# EAGLE design VibeBrain2 (EAGLE 9.6.2)
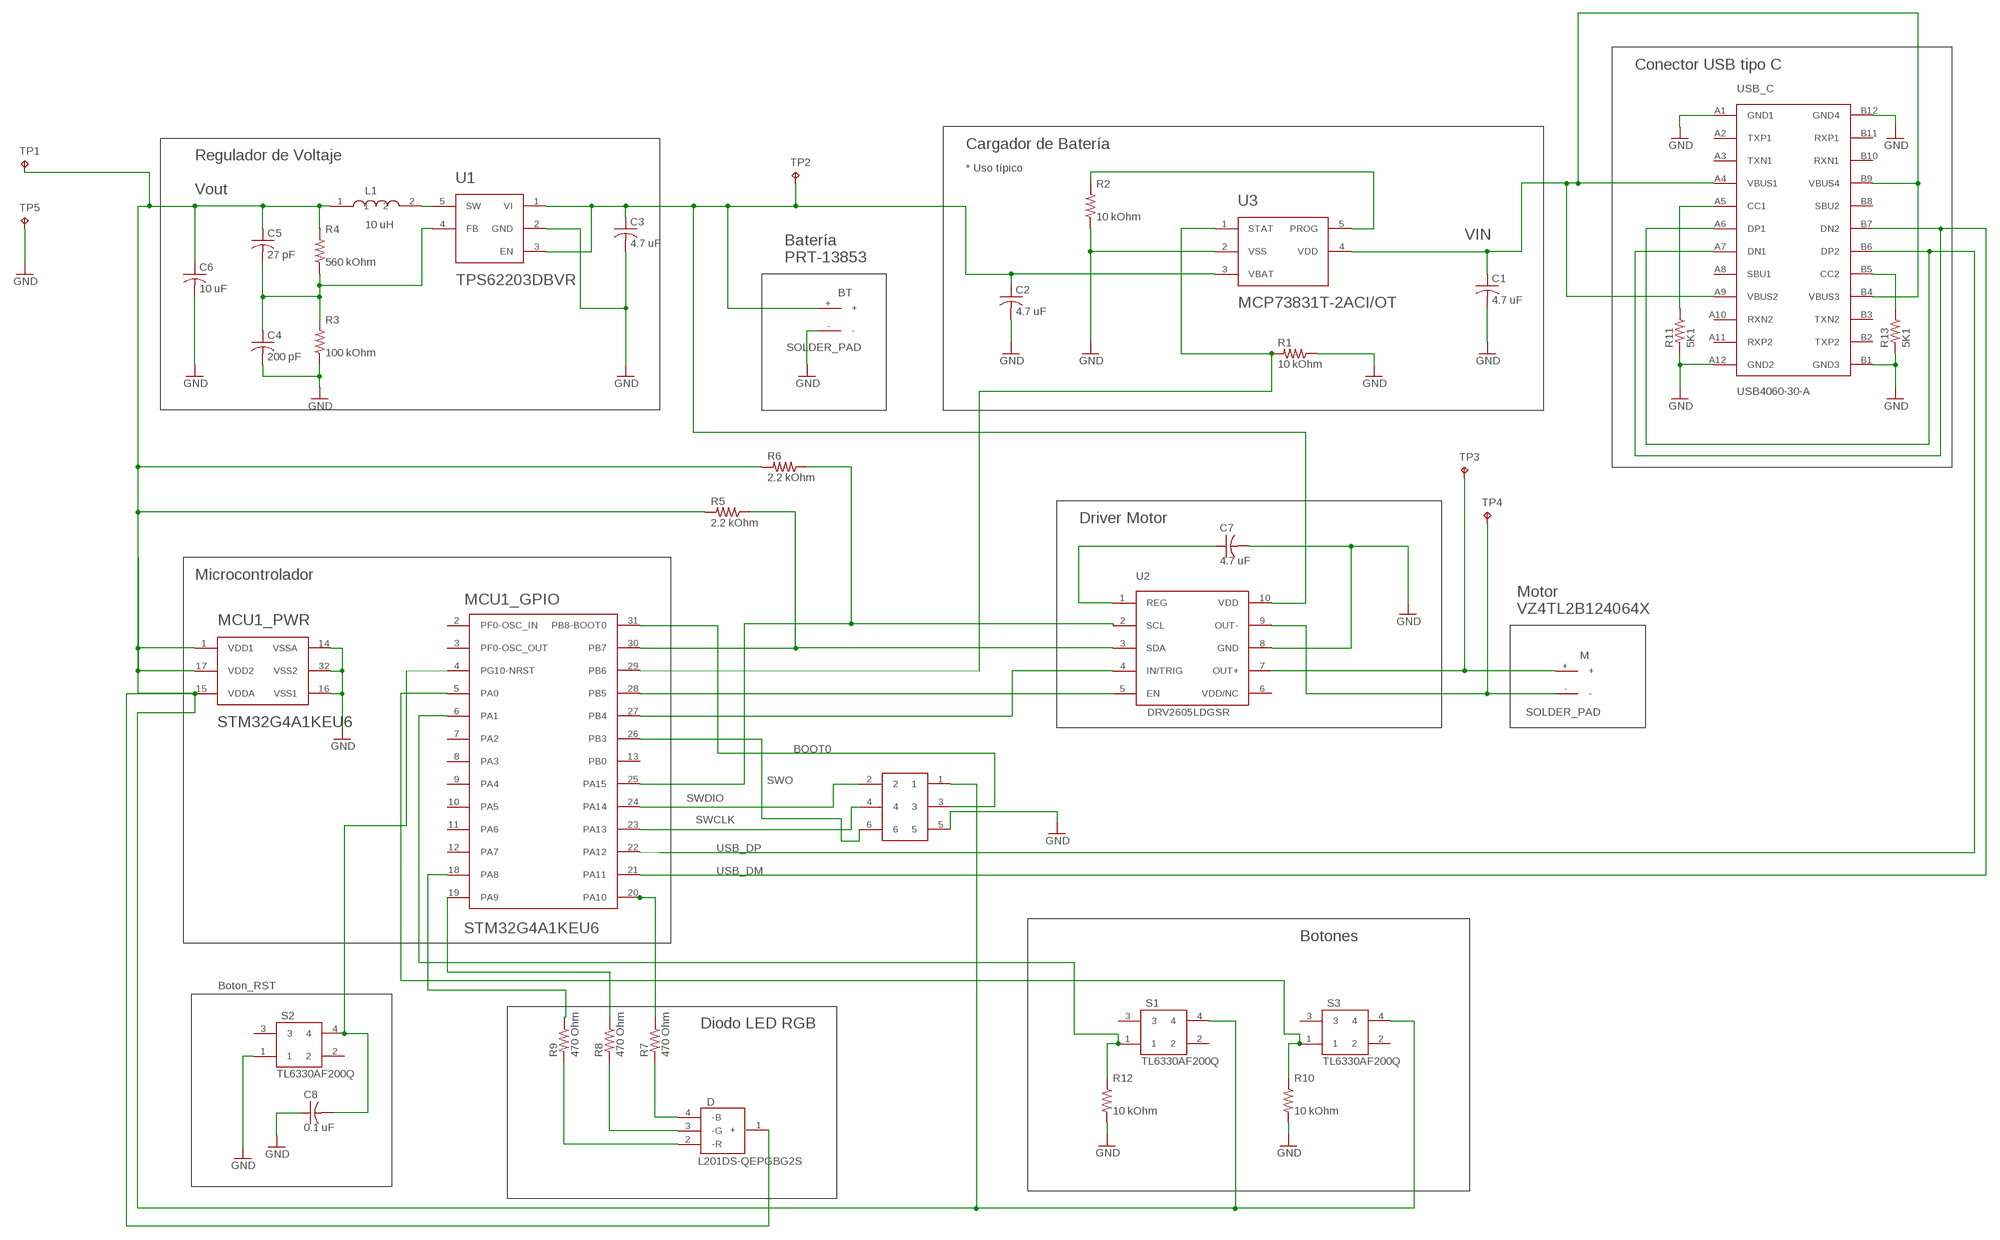
[diagram p0: schematic, sheet 1]

## Parts
BT  SOLDER_PAD  PADS  [SMD]
C1  4.7 uF  C-USC0402  [C0402]
C2  4.7 uF  C-USC0402  [C0402]
C3  4.7 uF  C-USC0402  [C0402]
C4  200 pF  C-USC0402  [C0402]
C5  27 pF  C-USC0402  [C0402]
C6  10 uF  C-USC0402  [C0402]
C7  4.7 uF  C-USC0402  [C0402]
C8  0.1 uF  C-USC0402  [C0402]
D  L201DS-QEPGBG2S  [SMD]
J1  TC2030-IDC  TC2030-IDC-FP  [TC2030-IDC-FP]
L1  10 uH  LQW15DN100M00D-ME  [SMD]
M  SOLDER_PAD  PADS  [SMD]
MCU1  STM32G4A1KEU6  STM32G4A1KEU6  [32-UFQFPN(5X5)]
R1  10 kOhm  R-US_R0402  [R0402]
R2  10 kOhm  R-US_R0402  [R0402]
R3  100 kOhm  R-US_R0402  [R0402]
R4  560 kOhm  R-US_R0402  [R0402]
R5  2.2 kOhm  R-US_R0402  [R0402]
R6  2.2 kOhm  R-US_R0402  [R0402]
R7  470 Ohm  R-US_R0402  [R0402]
R8  470 Ohm  R-US_R0402  [R0402]
R9  470 Ohm  R-US_R0402  [R0402]
R10  10 kOhm  R-US_R0402  [R0402]
R11  5K1  R-US_R0402  [R0402]
R12  10 kOhm  R-US_R0402  [R0402]
R13  5K1  R-US_R0402  [R0402]
S1  TL6330AF200Q  [SWITCH]
S2  TL6330AF200Q  [SWITCH]
S3  TL6330AF200Q  [SWITCH]
TP1  TPTP07SQ  [TP07SQ]
TP2  TPTP07SQ  [TP07SQ]
TP3  TPTP07SQ  [TP07SQ]
TP4  TPTP07SQ  [TP07SQ]
TP5  TPTP07SQ  [TP07SQ]
U1  TPS62203DBVR  [SOT-23-5]
U2  DRV2605LDGSR  [10-VSSOP]
U3  MCP73831T-2ACI/OT  MCP73831T-2ACI-OT  [SOT-23-5]
USB_C  USB4060-30-A  [USB_C]

## Nets
A2: C7.1 U2.1(REG)
FB: C4.1 C5.2 R3.2 R4.1 U1.4(FB)
GND: BT.- C1.2 C2.2 C3.2 C4.2 C6.2 C7.2 C8.1 J1.5 MCU1.14(_PWR:VSSA) MCU1.16(_PWR:VSS1) MCU1.32(_PWR:VSS2) R1.1 R2.1 R3.1 R10.2 R11.2 R12.2 R13.2 S2.1 TP5.TP U1.2(GND) U2.8(GND) U3.2(VSS) USB_C.A1(GND1) USB_C.A12(GND2) USB_C.B1(GND3) USB_C.B12(GND4)
N$1: MCU1.30(_GPIO:PB7) R5.1 U2.3(SDA)
N$2: MCU1.29(_GPIO:PB6) R1.2 U3.1(STAT)
N$3: J1.3 MCU1.31(_GPIO:PB8-BOOT0)
N$4: MCU1.28(_GPIO:PB5) U2.5(EN)
N$5: MCU1.27(_GPIO:PB4) U2.4(IN/TRIG)
N$6: M.+ TP3.TP U2.7(OUT+)
N$7: M.- TP4.TP U2.9(OUT-)
N$8: MCU1.22(_GPIO:PA12) USB_C.A6(DP1) USB_C.B6(DP2)
N$9: MCU1.19(_GPIO:PA9) R8.1
N$10: MCU1.21(_GPIO:PA11) USB_C.A7(DN1) USB_C.B7(DN2)
N$11: MCU1.5(_GPIO:PA0) R10.1 S3.1
N$12: MCU1.6(_GPIO:PA1) R12.1 S1.1
N$13: MCU1.20(_GPIO:PA10) R7.1
N$14: J1.2 MCU1.24(_GPIO:PA14)
N$15: D.4(-B) R7.2
N$16: D.3(-G) R8.2
N$17: D.2(-R) R9.2
N$18: J1.6 MCU1.26(_GPIO:PB3)
N$20: J1.4 MCU1.23(_GPIO:PA13)
N$21: MCU1.25(_GPIO:PA15) R6.1 U2.2(SCL)
N$22: L1.2 U1.5(SW)
N$23: C8.2 MCU1.4(_GPIO:PG10-NRST) S2.4
N$24: MCU1.18(_GPIO:PA8) R9.1
N$25: R11.1 USB_C.A5(CC1)
N$26: R13.1 USB_C.B5(CC2)
PROG: R2.2 U3.5(PROG)
REG_OUT: C5.1 C6.1 D.1(+) J1.1 L1.1 MCU1.1(_PWR:VDD1) MCU1.15(_PWR:VDDA) MCU1.17(_PWR:VDD2) R4.2 R5.2 R6.2 S1.4 S3.4 TP1.TP
VBAT: BT.+ C2.1 C3.1 TP2.TP U1.1(VI) U1.3(EN) U2.10(VDD) U3.3(VBAT)
VDD: C1.1 U3.4(VDD) USB_C.A4(VBUS1) USB_C.A9(VBUS2) USB_C.B4(VBUS3) USB_C.B9(VBUS4)
Unconnected: MCU1.2(_GPIO:PF0-OSC_IN) MCU1.3(_GPIO:PF0-OSC_OUT) MCU1.7(_GPIO:PA2) MCU1.8(_GPIO:PA3) MCU1.9(_GPIO:PA4) MCU1.10(_GPIO:PA5) MCU1.11(_GPIO:PA6) MCU1.12(_GPIO:PA7) MCU1.13(_GPIO:PB0) S1.2 S1.3 S2.2 S2.3 S3.2 S3.3 USB_C.A2(TXP1) USB_C.A3(TXN1) USB_C.A8(SBU1) USB_C.A10(RXN2) USB_C.A11(RXP2) USB_C.B2(TXP2) USB_C.B3(TXN2) USB_C.B8(SBU2) USB_C.B10(RXN1) USB_C.B11(RXP1)

## Notes on the sheet
- Conector USB tipo C
- Cargador de Batería
- Regulador de Voltaje
- * Uso típico
- Vout
- VIN
- Batería
  PRT-13853
- Driver Motor
- Microcontrolador
- Motor
  VZ4TL2B124064X
- BOOT0
- SWO
- SWDIO
- SWCLK
- USB_DP
- USB_DM
- Botones
- Boton_RST
- Diodo LED RGB

## Power pins joined to a net without a drawn wire
VDD/NC: U2.6(VDD/NC)

## Library data of the parts
BT M = PADS:PADS
C1-C3 C7 = rcl:C-US: CAPACITOR, American symbol; PARTNO: GRM155R60J475ME47J; SPICEPREFIX: C
C4 = rcl:C-US: CAPACITOR, American symbol; PARTNO: GCM1555C1H201FA16D; SPICEPREFIX: C
C5 = rcl:C-US: CAPACITOR, American symbol; PARTNO: GCM1555C1H270JA16D; SPICEPREFIX: C
C6 = rcl:C-US: CAPACITOR, American symbol; PARTNO: GRM155R60J106ME05J; SPICEPREFIX: C
C8 = rcl:C-US: CAPACITOR, American symbol; PARTNO: GCM155R71C104KA55J; SPICEPREFIX: C
D = L201DS-QEPGBG2S-American Opto Plus LED:L201DS-QEPGBG2S; PARTNO: L201DS-QEPGBG2S
J1 = TC2030-IDC:TC2030-IDC-FP; PARTNO: TC2030-IDC
L1 = LQW15DN100M00D:LQW15DN100M00D-ME; PARTNO: LQW15DN100M00D
MCU1 = STM32G4A1KEU6-STM:STM32G4A1KEU6; PARTNO: STM32G4A1KEU6
R1 R2 R10 R12 = rcl:R-US_: RESISTOR, American symbol; PARTNO: RMCF0402FT10K0; SPICEPREFIX: R
R3 = rcl:R-US_: RESISTOR, American symbol; PARTNO: RMCF0402FT100K; SPICEPREFIX: R
R4 = rcl:R-US_: RESISTOR, American symbol; PARTNO: ERJ-2RKF5603X; SPICEPREFIX: R
R5 R6 = rcl:R-US_: RESISTOR, American symbol; PARTNO: RMCF0402JT2K20; SPICEPREFIX: R
R7-R9 = rcl:R-US_: RESISTOR, American symbol; PARTNO: RMCF0402FT470R; SPICEPREFIX: R
R11 R13 = rcl:R-US_: RESISTOR, American symbol; PARTNO: RC0402FR-075K1L; SPICEPREFIX: R
S1-S3 = TL6330AF200Q-E-SWITCH:TL6330AF200Q; PARTNO: TL6330AF200Q
TP1-TP5 = testpad:TP: Test pad
U1 = TPS62203DBVR-TI:TPS62203DBVR; PARTNO: TPS62203DBVR
U2 = DRV2605LDGSR-TI:DRV2605LDGSR; PARTNO: DRV2605LDGSR
U3 = MCP73831T_2ACI_OT-MT:MCP73831T-2ACI-OT; PARTNO: MCP73831T-2ACI/OT
USB_C = USB4060-30-A-GCT:USB4060-30-A; PARTNO: USB4060-30-A

## Board
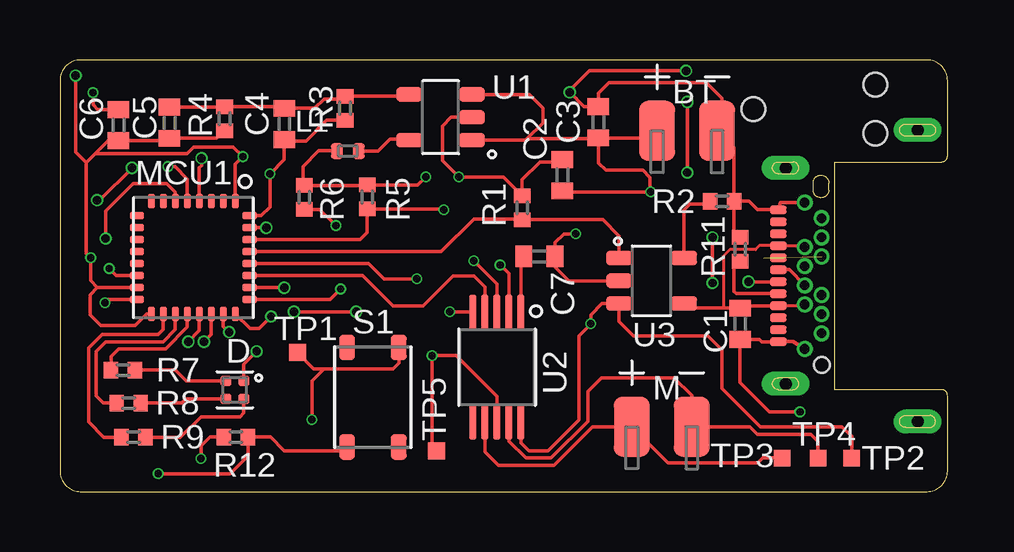
[diagram p1: board, top side]
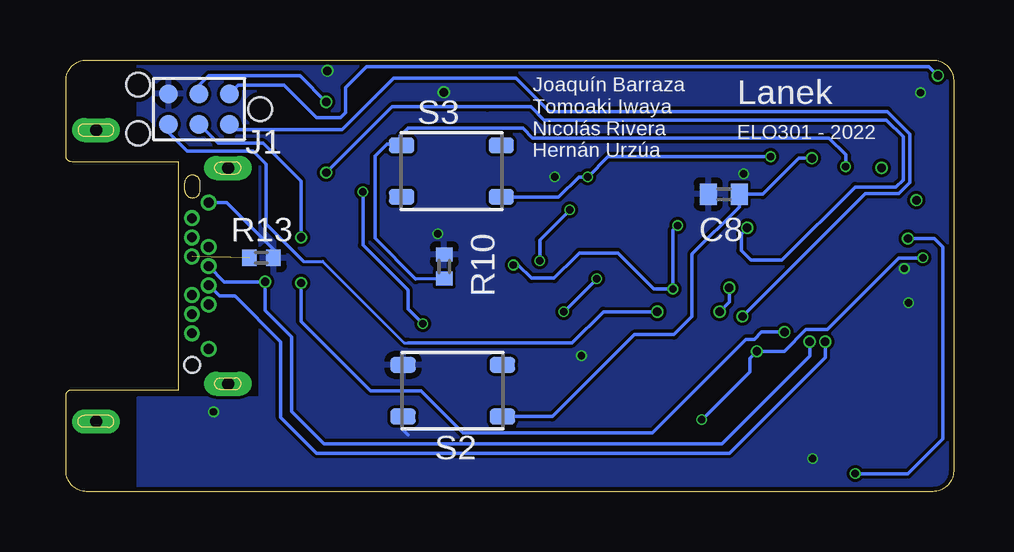
[diagram p2: board, bottom side, seen from below]

Size 37 x 18 mm. Coordinates in mm from the lower left corner, seen from the top.
Outline: 32.3,4.25 32.3,13.75 36.75,13.75 arc90 37,14 37,17.15 arc90 36.15,18 0.85,18 arc90 0,17.15 0,0.85 arc90 0.85,0 36.15,0 arc90 37,0.85 37,4 arc90 36.75,4.25 32.3,4.25
Copper layers (1*16): Top 0.035mm / dielectric 1.6mm / Bottom 0.035mm
Design rules "jlcpcb-2layers *": minimum track width 5mil, minimum drill 0.3mm, track to track 5mil, track to pad 5mil, pad to pad 5mil, via to via 5mil, smd to smd 5mil, copper to edge 0.2mm, drill to drill 6mil, minimum pad ring 0.13mm, minimum via ring 3mil, stop-mask expansion 4mil, vias tented up to drill 15mil, thermal gap 10mil

### Footprints (pad centres in the part's own frame; a part is rotated, then mirrored left to right if it is on the bottom)
SMD = smd 1.5 x 2.5: + -1.25,0; - 1.25,0
C0402 = smd 0.7 x 0.9: 1 -0.65,0; 2 0.65,0
SMD' = smd 0.45 x 0.45: 1 0.375,0.375; 2 0.375,-0.375; 3 -0.375,-0.375; 4 -0.375,0.375
TC2030-IDC-FP = smd 0.787 x 0.787: 1 -1.27,-0.635; 2 -1.27,0.635; 3 0,-0.635; 4 0,0.635; 5 1.27,-0.635; 6 1.27,0.635 | hole 0.993: 2.54,-1.016; 2.54,1.016; -2.54,0
SMD'' = smd 0.5 x 0.66: 1 -0.45,0; 2 0.45,0
32-UFQFPN(5X5) = smd 0.6 x 0.3: 1 -2.35,1.75; 2 -2.35,1.25; 3 -2.35,0.75; 4 -2.35,0.25; 5 -2.35,-0.25; 6 -2.35,-0.75; 7 -2.35,-1.25; 8 -2.35,-1.75; 17 2.35,-1.75; 18 2.35,-1.25; 19 2.35,-0.75; 20 2.35,-0.25; 21 2.35,0.25; 22 2.35,0.75; 23 2.35,1.25; 24 2.35,1.75 | smd 0.3 x 0.6: 9 -1.75,-2.35; 10 -1.25,-2.35; 11 -0.75,-2.35; 12 -0.25,-2.35; 13 0.25,-2.35; 14 0.75,-2.35; 15 1.25,-2.35; 16 1.75,-2.35; 25 1.75,2.35; 26 1.25,2.35; 27 0.75,2.35; 28 0.25,2.35; 29 -0.25,2.35; 30 -0.75,2.35; 31 -1.25,2.35; 32 -1.75,2.35
R0402 = smd 0.6 x 0.7: 1 -0.5,0; 2 0.5,0
SWITCH = smd 1.05 x 0.65: 1 -2.075,1.075; 2 2.075,1.075; 3 -2.075,-1.075; 4 2.075,-1.075
TP07SQ = smd 0.7 x 0.7: TP 0,0
SOT-23-5 = smd 1.1 x 0.6: 1 -1.3,0.95; 2 -1.3,0; 3 -1.3,-0.95; 4 1.3,-0.95; 5 1.3,0.95
10-VSSOP = smd 1.45 x 0.3: 1 -2.3,1; 2 -2.3,0.5; 3 -2.3,0; 4 -2.3,-0.5; 5 -2.3,-1; 6 2.3,-1; 7 2.3,-0.5; 8 2.3,0; 9 2.3,0.5; 10 2.3,1
SOT-23-5' = smd 1.1 x 0.6: 1 -1.35,0.9; 2 -1.35,-0.05; 3 -1.35,-1; 4 1.35,-1; 5 1.35,0.9
USB_C = smd 0.35 x 0.7: A1 -2.749,1.11; A2 -2.249,1.11; A3 -1.749,1.11; A4 -1.249,1.11; A5 -0.749,1.11; A6 -0.249,1.11; A7 0.251,1.11; A8 0.751,1.11; A9 1.251,1.11; A10 1.751,1.11; A11 2.251,1.11; A12 2.751,1.11 | drill 0.4 pad 0.65: B1 3.05,0; B2 2.4,-0.7; B3 1.6,-0.7; B4 1.2,0; B5 0.8,-0.7; B6 0.4,0; B7 -0.4,0; B8 -0.8,-0.7; B9 -1.2,0; B10 -1.6,-0.7; B11 -2.4,-0.7; B12 -3.05,0 | drill 0.5 pad 1 long: SHIELD1 -4.5,0.8; SHIELD2 4.5,0.8; SHIELD3 -6.075,-4.7; SHIELD4 6.075,-4.7 | hole 0.65: -3.725,-0.7

### Placement (x,y rotation side)
BT  26.14,15.05 0 top
C1  28.35,7 270 top
C2  20.95,13.2 90 top
C3  22.45,15.4 90 top
C4  9.35,15.33 270 top
C5  4.57,15.38 90 top
C6  2.44,15.28 90 top
C7  19.98,9.8 0 top
C8  9.57,12.4 0 bottom
D  L201DS-QEPGBG2S  [SMD']  7.29,4.24 0 top
J1  31.45,15.95 180 bottom
L1  10 uH  [SMD'']  12,14.2 0 top
M  25.09,2.7 0 top
MCU1  5.56,9.76 270 top
R1  19.27,11.84 270 top
R2  27.6,12.11 180 top
R3  11.89,15.98 90 top
R4  6.86,15.55 270 top
R5  12.81,12.29 90 top
R6  10.19,12.27 90 top
R7  2.63,5.07 0 top
R8  2.87,3.69 0 top
R9  3.07,2.27 0 top
R10  21.23,9.38 90 bottom
R11  28.35,10.1 90 top
R12  7.33,2.27 180 top
R13  28.85,9.75 0 bottom
S1  13.04,3.94 90 top
S2  20.88,4.21 0 bottom
S3  20.93,13.37 0 bottom
TP1  9.9,5.8 0 top
TP2  33,1.4 0 top
TP3  30.1,1.4 0 top
TP4  31.6,1.4 0 top
TP5  15.7,1.7 0 top
U1  15.87,15.61 180 top
U2  18.21,5.19 270 top
U3  MCP73831T-2ACI/OT  [SOT-23-5']  24.66,8.84 0 top
USB_C  31.05,9 90 top

### Tracks (layer width: path | path; a pad name or v marks a point on that pad's centre or on a via)
A2
  Top 0.152: C7.1 19.21,9.69 U2.1
FB
  Top 0.152: C5.2 6.84,16.03 R4.1 9.28,16.05 C4.1 10.61,15.98 11,16.38 11.78,16.38 R3.2 14.49,16.48 U1.4
GND  (via drill 0.3, 0.35)
  Top 0.152: MCU1.16 2.01,8.01 v1.88,7.88 | R12.2 6.25,2.27 5.88,1.9 v5.88,1.38 | C6.2 1.58,15.93 1.38,16.13 v1.38,16.63 | C4.2 9.35,14.62 | 9.35,14.62 9.35,13.85 v8.75,13.25 8.75,11.88 8.38,11.51 MCU1.32 | R3.1 11.11,15.48 10.25,14.62 9.35,14.62 | U2.8 18.21,3.97 16.52,5.67 v15.52,5.67 15.52,1.89 TP5.TP | U3.2 21.21,8.79 20.63,9.37 C7.2 20.63,10.38 21,10.75 v21.5,10.75 | R2.1 28.1,14.34 BT.- 27.6,15.26 27.6,16.4 26.95,17.05 22.89,17.05 22.45,16.61 C3.2 21.85,16.05 v21.25,16.65 | C2.2 20.85,13.75 20,13.75 19.27,13.02 R1.1 18.48,13.12 v16.62,13.12 15.95,13.8 15.95,15.25 16.31,15.61 U1.2 | R2.1 28.71,12.11 29.07,11.75 USB_C.A12 30.04,12.05 USB_C.B1 | v30.85,3.33 29.57,3.33 28.35,4.55 C1.2 29.15,6.35 29.25,6.25 29.74,6.25 USB_C.A1 30.55,6.25 USB_C.B12 | MCU1.14 2.34,9.01 v2.05,9.3 | v26.1,17.55 22.07,17.55 21.25,16.73 v21.25,16.65 | 21.27,16.63 v21.25,16.65 | R11.2 28.1,10.85 R2.1
  Bottom 0.152: 22.93,2.56 22.74,2.36 | R13.2 28.35,10.1 30.3,12.05 USB_C.B1
  pour Bottom: -0.1,17.9 -0.1,-0.05 34,0.05 34,3.9 28.9,3.9 28.9,14.1 34,14.1 34,18
N$1  (via drill 0.3)
  Top 0.152: v16,11.75 15.96,11.79 R5.1 12.81,10.81 12.51,10.51 MCU1.30 | v17.25,9.62 18.21,8.66 U2.3
  Bottom 0.152: v16,11.75 17.25,10.5 v17.25,9.62
N$2
  Top 0.152: U3.1 23.31,10.66 22.64,11.34 R1.2 19.23,11.38 17.25,11.38 15.88,10.01 MCU1.29
N$3  (via drill 0.35)
  Top 0.152: v26.15,13.3 v26.15,16.25 | MCU1.31 v8.59,11.01 v8.6,11
  Bottom 0.152: v26.15,13.3 23.4,16.05 19.43,16.05 17.62,16.05 17.07,15.5 2.8,15.5 2.1,14.8 2.1,13 2.4,12.7 4.1,12.7 7.15,9.65 8.45,9.65 8.85,10.05 8.85,10.75 v8.6,11 | J1.3 31.45,16.94 31.04,17.35 27.25,17.35 v26.15,16.25
N$4  (via drill 0.3)
  Top 0.152: U2.5 v16.26,7.49 v16.25,7.5 | v14.88,8.88 13.5,8.88 12.87,9.51 MCU1.28
  Bottom 0.152: v16.25,7.5 v14.88,8.88
N$5
  Top 0.152: U2.4 17.71,8.54 17.25,9 16.38,9 15.12,7.75 13.88,7.75 12.62,9.01 MCU1.27
N$6
  Top 0.152: U2.7 17.71,1.66 18.28,1.09 20.59,1.09 22.2,2.7 M.+ 25.34,1.2 29.1,1.2 29.3,1.4 TP3.TP
N$7
  Top 0.152: U2.9 18.71,2.1 19.42,1.4 20.47,1.4 22,2.93 22,4.17 22.57,4.75 25.6,4.75 26.34,4.01 M.- 28.77,2.7 29.07,2.4 31.3,2.4 31.6,2.1 TP4.TP
N$8  (via drill 0.35)
  Top 0.152: v28.7,8.75 USB_C.A6 | MCU1.22 6.31,6.56 v6,6.25
  Bottom 0.152: USB_C.B6 30.4,8.75 v28.7,8.75 28.7,7.55 27.6,6.45 27.6,3.35 26.25,2 9.65,2 6,5.65 v6,6.25
N$9
  Top 0.152: MCU1.19 4.81,6.76 4.3,6.25 1.9,6.25 1.5,5.85 1.5,4 1.81,3.69 R8.1
N$10  (via drill 0.35)
  Top 0.152: USB_C.A7 30.4,9.25 USB_C.B7 | MCU1.21 5.81,6.71 v5.35,6.25
  Bottom 0.152: v5.35,6.25 5.35,5.6 9.35,1.6 26.55,1.6 28.05,3.1 28.05,6.25 29.95,8.15 30.6,8.15 USB_C.B7
N$11  (via drill 0.3)
  Top 0.152: MCU1.5 5.31,13.04 4.8,13.55 v4.5,13.55
  Bottom 0.152: R10.1 22.42,8.86 24.12,10.57 24.12,14 23.62,14.5 23.07,14.5 | 23.07,14.5 S3.1 | 23.07,14.5 23.07,14.84 22.75,15.15 22.5,15.15 17.95,15.15 17.55,14.75 5.2,14.75 4.5,14.05 v4.5,13.55
N$12  (via drill 0.3, 0.35)
  Top 0.152: S1.1 11.81,1.7 9.35,1.7 8.78,2.27 R12.1 7.85,2.26 7.85,1.5 7.1,0.75 v4.1,0.75 | MCU1.6 4.8,12.5 4.45,12.85 3.05,12.85 1.9,11.7 v1.9,10.55
  Bottom 0.152: v4.1,0.75 1.9,0.75 0.45,2.2 0.45,10.2 0.8,10.55 v1.9,10.55
N$13
  Top 0.152: MCU1.20 5.31,6.86 4.4,5.95 2.45,5.95 2.13,5.63 R7.1
N$14  (via drill 0.35)
  Top 0.152: MCU1.24 7.92,6.8 8.3,6.8 v8.8,7.3
  Bottom 0.152: J1.2 29.96,15.1 25.5,15.1 23.34,17.25 18.25,17.25 16.85,15.85 2.75,15.85 1.82,14.92 1.82,12.88 2.28,12.42 3.68,12.42 v8.8,7.3
N$15
  Top 0.152: R7.2 4.81,5.07 5.26,4.62 D.4
N$16
  Top 0.152: R8.2 5.07,3.69 5.25,3.88 D.3
N$17
  Top 0.152: R9.2 5.02,2.27 5.88,3.12 7.5,3.12 7.66,3.29 D.2
N$18  (via drill 0.35)
  Top 0.152: v12.35,7.5 v9.75,7.5 | MCU1.26 v9.34,8.51 v9.35,8.5
  Bottom 0.127: 27.1,9.6 26.3,9.6 22.9,6.2 22.75,6.2
  Bottom 0.152: J1.6 32.72,14.97 31.95,14.2 29.46,14.2 29.2,14.2 28.65,13.65 28.65,11.15 27.1,9.6 | 22.75,6.2 15.9,6.2 14.6,7.5 v12.35,7.5 | v9.75,7.5 9.35,7.9 v9.35,8.5
N$19  (via drill 0.35)
  Top 0.152: v3,13.5 1.65,12.15 v1.55,12.15
N$20  (via drill 0.35)
  Top 0.152: MCU1.23 6.81,6.89 v7.05,6.65 | v27.2,8.7 v27.2,10.6
  Bottom 0.152: v7.05,6.65 8.01,6.65 8.31,6.35 8.65,6.35 12.55,2.45 20.45,2.45 22.2,4.2 24.3,4.2 27.2,7.1 v27.2,8.7 | J1.4 30.66,14.53 28.78,14.53 27.2,12.95 v27.2,10.6
N$21  (via drill 0.3)
  Top 0.152: MCU1.25 11.26,8.01 v11.7,8.45 | v11.5,11.1 10.83,11.77 R6.1 | v18.35,9.45 18.71,9.09 U2.2
  Bottom 0.152: v11.5,11.1 11.7,10.9 v11.7,8.45 12.5,8.45 14,9.95 15.6,9.95 15.7,9.85 15.75,9.8 16.65,8.9 17.6,8.9 18.15,9.45 v18.35,9.45
N$22
  Top 0.152: L1.2 13.25,14.2 13.75,14.7 14.53,14.7 U1.5
N$23  (via drill 0.35)
  Top 0.152: v5.9,13.9 5.9,13.6 5.81,13.51 MCU1.4
  Bottom 0.152: S2.4 16.72,3.13 13.3,6.55 11.65,6.55 10.9,7.3 10.9,9.9 8.93,11.88 C8.2 7.95,12.4 6.45,13.9 v5.9,13.9
N$24
  Top 0.152: MCU1.18 4.31,6.76 4.1,6.55 1.75,6.55 1.2,6 1.2,2.9 1.83,2.27 R9.1
N$25
  Top 0.152: USB_C.A5 28.2,8.25 28.1,8.35 28.1,9.35 R11.1
N$26  (1 unrouted)
PROG
  Top 0.152: U3.5 26,11.75 26.25,12 27,12 R2.2
REG_OUT  (via drill 0.3, 0.35)
  Top 0.152: MCU1.17 3.6,7.41 3.12,6.93 1.7,6.93 1.25,7.38 1.25,8.2 1.56,8.51 | 1.56,8.51 MCU1.15 | R4.2 6.54,14.73 C5.1 4.47,14.63 C6.1 2,14.63 1.48,14.1 | v10.5,3 10.5,4.62 11,5.12 | v15.25,13.12 14.91,12.79 R5.2 12.79,12.77 R6.2 10.12,12.77 10.12,13.55 10.78,14.21 L1.1 | 1.09,13.72 1.48,14.1 | 11,5.12 13.88,5.12 14.12,5.38 S1.4 | TP1.TP 10.57,5.12 11,5.12 | v8.2,5.85 7.66,5.31 D.1 | 1.09,13.72 1.09,9.93 v1.27,9.75 1.27,8.8 1.56,8.51 | 1.48,14.1 5.3,14.1 5.58,14.38 7.22,14.38 v7.62,13.97 7.31,13.66 MCU1.1 | v0.65,17.35 0.65,14.16 1.09,13.72
  Bottom 0.152: v1.27,9.75 2.27,9.75 5.27,6.76 6.15,6.76 7.06,5.85 v8.2,5.85 8.5,5.55 8.5,5 v10.5,3 | S3.4 16.46,12.29 15.62,13.12 v15.25,13.12 14.4,13.97 v7.62,13.97 | v0.65,17.35 1.02,17.72 24.48,17.72 25.35,16.85 25.35,15.8 25.55,15.6 26.55,15.6 27.9,16.95 29.82,16.95 J1.1
VBAT  (via drill 0.3)
  Top 0.152: U1.3 19.57,16.56 20.12,16 20.12,15.38 19.48,14.72 | U1.1 19.41,14.66 19.48,14.72 | BT.+ 24.54,14.7 24.49,14.75 C3.1 | U2.10 19.21,2.04 19.55,1.7 20.34,1.7 21.62,2.99 21.62,6.5 v22.12,7 22.12,7.38 22.59,7.84 U3.3 23.31,7.09 23.9,6.5 27,6.5 27.6,5.9 27.6,4.3 29.2,2.7 32.6,2.7 33,2.3 TP2.TP | v24.62,12.5 24.6,12.5 | 24.6,12.5 20.99,12.5 C2.1 | 24.6,12.5 24.6,13.1 24.3,13.4 22.75,13.4 22.45,13.7 C3.1 | 19.48,14.72 22.43,14.72 C3.1
  Bottom 0.152: v24.62,12.5 24.62,10.28 22.75,8.4 22.75,7.62 v22.12,7
VDD
  Top 0.127: USB_C.B4 31,10.25 USB_C.A9 29.15,10.25 28.99,10.09 27.92,10.09 27.65,9.82 27.65,7.65 | USB_C.A4 31,7.75 USB_C.B9
  Top 0.152: U3.4 26.2,7.65 27.65,7.65 C1.1 28.45,7.75 29.74,7.75 USB_C.A4

### Text on the board
bNames: Lanek | ELO301 - 2022 | Joaquín Barraza / Tomoaki Iwaya / Nicolás Rivera / Hernán Urzúa